# Altium schematic sheet DCDC_stepdown.SchDoc
size 381 x 304 mm; DrawnBy: Constanza Barriga
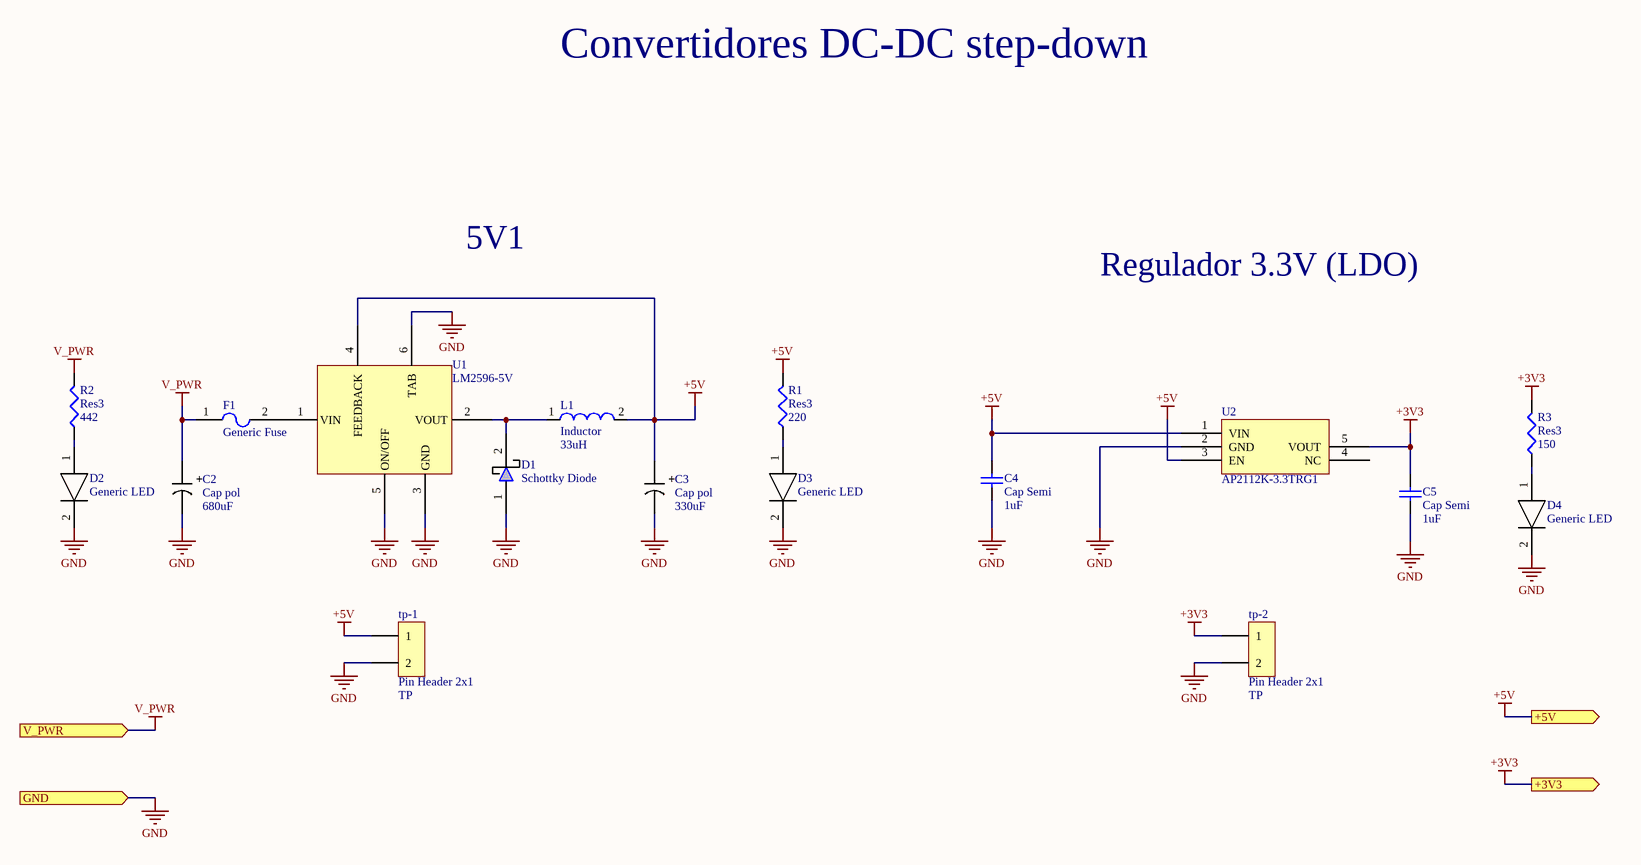
[diagram p0: DCDC_stepdown.SchDoc]

## Parts
C2  Cap pol  value 680uF  [CAP_SMD_Electrolytic_10x10]
C3  Cap pol  value 330uF  [CAP_SMD_Electrolytic_10x10]
C4  Cap Semi  value 1uF  [1608[0603]]
C5  Cap Semi  value 1uF  [1608[0603]]
D1  Schottky Diode  [SMB_L4.6-W3.6-LS5.3-RD]
D2  Generic LED  [LED0603]
D3  Generic LED  [LED0603]
D4  Generic LED  [LED0603]
F1  Generic Fuse  [F1206]
L1  Inductor  value 33uH  [IND-SMD_L12.5-W12.5_SMDRS1275]
R1  Res3  value 220  [J1-0603]
R2  Res3  value 442  [J1-0603]
R3  Res3  value 150  [J1-0603]
tp-1  Pin Header 2x1  [HDR-TH_P2.54-H-M_A2541WV-2P]
tp-2  Pin Header 2x1  [HDR-TH_P2.54-H-M_A2541WV-2P]
U1  LM2596-5V  [TO-263-5]
U2  AP2112K-3.3TRG1  [SOT25-5]

## Ports
+3V3 (out), +5V (out), GND (in), V_PWR (in)

## Nets
+3V3: C5.2 R3.2 tp-2.1 U2.5(VOUT) ; port +3V3
+5V: C3.2 C4.2 L1.2 R1.2 tp-1.1 U1.4(FEEDBACK) U2.1(VIN) U2.3(EN) ; port +5V
GND: C2.1 C3.1 C4.1 C5.1 D1.1(+) D2.2 D3.2 D4.2 tp-1.2 tp-2.2 U1.3(GND) U1.5(ON/OFF) U1.6(TAB) U2.2(GND) ; port GND
V_PWR: C2.2 F1.1 R2.2 ; port V_PWR
NetD1_2: D1.2(-) L1.1 U1.2(VOUT)
NetD2_1: D2.1 R2.1
NetD3_1: D3.1 R1.1
NetD4_1: D4.1 R3.1
NetF1_2: F1.2 U1.1(VIN)

Not connected (* = marked no-connect by the designer): U2 4(NC)

## Notes on the sheet
- Convertidores DC-DC step-down
- 5V1
- Regulador 3.3V (LDO)
- (near tp-1) TP
- (near tp-2) TP
- (in symbol Cap pol) +

## Library data of the parts
C2 = Cap pol: Electrolytic Aluminium Capacitor; Manufacturer: PANASONIC; Manufacturer Part Number: EEEFK1V681AQ; Voltage: 35V; Supplier 1: LCSC; Supplier Part Number 1: C178568; Package: SMD,12.5x13.5mm
C3 = Cap pol: Electrolytic Aluminium Capacitor; Manufacturer: PANASONIC; Manufacturer Part Number: EEE1VA331UAP; Voltage: 35V; Description: -45℃~+105℃ 35V 2000hrs 105℃ 330uF 10mm ±20% 10mm SMD,10x10mm Aluminum Electrolytic Capacitors - SMD ROHS; Supplier 1: LCSC; Supplier Part Number 1: C249650; Package: SMD, 10X10mm
C4 C5 = Cap Semi: Capacitor (Semiconductor SIM Model); Manufacturer: Samsung Electro-Mechanics; Manufacturer Part Number: CL10B105KO8NNNC; Description: X7R ±10% 1uF 16V 0603 Multilayer Ceramic Capacitors MLCC - SMD/SMT ROHS; Published: 8-Jun-2000; LatestRevisionDate: 29-May-2009; LatestRevisionNote: IPC-7351 Footprint Added.; PackageReference: C0603; Publisher: Altium Limited; PackageDescription: Chip Capacitor; Supplier 1: LCSC; Supplier Part Number 1: C59782
D1 = Schottky Diode: Schottky Diodes; Manufacturer: MCC(Micro Commercial Components); Manufacturer Part Number: SK32B-LTP; Reverse voltage: 20V; Description: 20V 3A 500mV @ 3A SMB(DO-214AA) Schottky Barrier Diodes (SBD) ROHS; Package: SMB; Supplier 1: LCSC; Supplier Part Number 1: C180191
D2-D4 = LED: Generic LED SMD; Color: Green; Description: Green 520~535nm 0603 Light Emitting Diodes (LED) ROHS; Package: 0603; Supplier 1: LCSC; Supplier Part Number 1: C72043
F1 = FUSE: SMD Fuse; Manufacturer: AEM; Manufacturer Part Number: F1206VH4500TM; Rated Voltage AC: 65V; Current Rating: 4.5A; Description: 3.9 60A 4.5A SMD Ceramic Fuse 24mΩ 1206 Fuses ROHS; Supplier 1: LCSC; Supplier Part Number 1: C310980; Package: 1206
L1 = Inductor: Inductor SMD; Manufacturer: GLE; Manufacturer Part Number: GCRH127M-330MC; Description: SMD Power Inductors ROHS; Supplier 1: LCSC; Supplier Part Number 1: C439422; Package: SMD,12.3x12.3x8mm
R1 = Res3: ±1% ±100ppm/℃ 0.1W 220Ω 0603 Chip Resistor - Surface Mount ROHS; Manufacturer Part Number: AC0603FR-07442RL; Manufacturer: YAGEO; Published: 8-Jun-2000; LatestRevisionDate: 29-May-2009; LatestRevisionNote: IPC-7351 Footprint Added.; PackageReference: J1-0603; Publisher: Altium Limited; PackageDescription: Chip Resistor; Supplier 1: LCSC; Supplier Part Number 1: C304718
R2 = Res3: Resistor; Manufacturer Part Number: AC0603FR-07442RL; Manufacturer: YAGEO; Description: ±1% 442Ω ±100ppm/℃ 0.1W 0603 Chip Resistor - Surface Mount ROHS; Published: 8-Jun-2000; LatestRevisionDate: 29-May-2009; LatestRevisionNote: IPC-7351 Footprint Added.; PackageReference: J1-0603; Publisher: Altium Limited; PackageDescription: Chip Resistor; Supplier 1: LCSC; Supplier Part Number 1: C23057
R3 = Res3: Resistor; Manufacturer Part Number: AC0603FR-07442RL; Manufacturer: YAGEO; Description: ±1% ±100ppm/℃ 150Ω 0.1W 0603 Chip Resistor - Surface Mount ROHS; Published: 8-Jun-2000; LatestRevisionDate: 29-May-2009; LatestRevisionNote: IPC-7351 Footprint Added.; PackageReference: J1-0603; Publisher: Altium Limited; PackageDescription: Chip Resistor; Supplier 1: LCSC; Supplier Part Number 1: C114608
tp-1 tp-2 = Header - 2x1c: Pin Header 2pos, 1 row, 2.54 pitch; Manufacturer: CJT(Changjiang Connectors); Manufacturer Part Number: A2541WV-2P; Pitch: 2.54; Supplier 1: LCSC; Supplier Part Number 1: C492401
U1 = LM2596-5V: Step-Down Positive Fixed 1 3A 150kHz TO-263-5 DC-DC Converters RoHS; Manufacturer: HTC Korea TAEJIN Tech; Manufacturer Part Number: LM2596R-5.0; Description: 3A 40V TO-263-5 DC-DC Converters ROHS; Package: TO-263-5; Supplier 1: LCSC; Supplier Part Number 1: C77782
U2 = AP2112K-3.3: 600mA CMOS LDO REGULATOR WITH ENABLE; Manufacturer: DIODES; Description: 6V 400mV @ 600mA Fixed 3.3V SOT-25 Linear Voltage Regulators (LDO) ROHS; Package: SOT-25-5_L3.0-W1.8-P0.95-LS3.0-BL; Supplier 1: LCSC; Supplier Part Number 1: C150742; Manufacturer Part Number: AP2112K-3.3TRG1